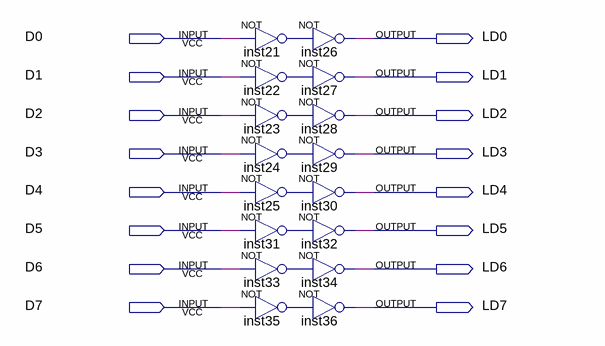
[diagram p0: schematic sheet]
// Quartus schematic 8wirebus8.bdf as structural Verilog: 16 symbols, 16 pins
module \8wirebus8  (
  input  D0,
  input  D1,
  input  D2,
  input  D3,
  input  D4,
  input  D5,
  input  D6,
  input  D7,
  output LD0,
  output LD1,
  output LD2,
  output LD3,
  output LD4,
  output LD5,
  output LD6,
  output LD7
);

  wire inst21_out, inst22_out, inst23_out, inst24_out, inst25_out, inst31_out, inst33_out, inst35_out;

  not inst21 (inst21_out, D0);
  not inst22 (inst22_out, D1);
  not inst23 (inst23_out, D2);
  not inst24 (inst24_out, D3);
  not inst25 (inst25_out, D4);
  not inst31 (inst31_out, D5);
  not inst33 (inst33_out, D6);
  not inst35 (inst35_out, D7);
  not inst26 (LD0, inst21_out);
  not inst27 (LD1, inst22_out);
  not inst28 (LD2, inst23_out);
  not inst29 (LD3, inst24_out);
  not inst30 (LD4, inst25_out);
  not inst32 (LD5, inst31_out);
  not inst34 (LD6, inst33_out);
  not inst36 (LD7, inst35_out);
endmodule
